# EAGLE design PCM5102A_Breakout (EAGLE 9.6.2)
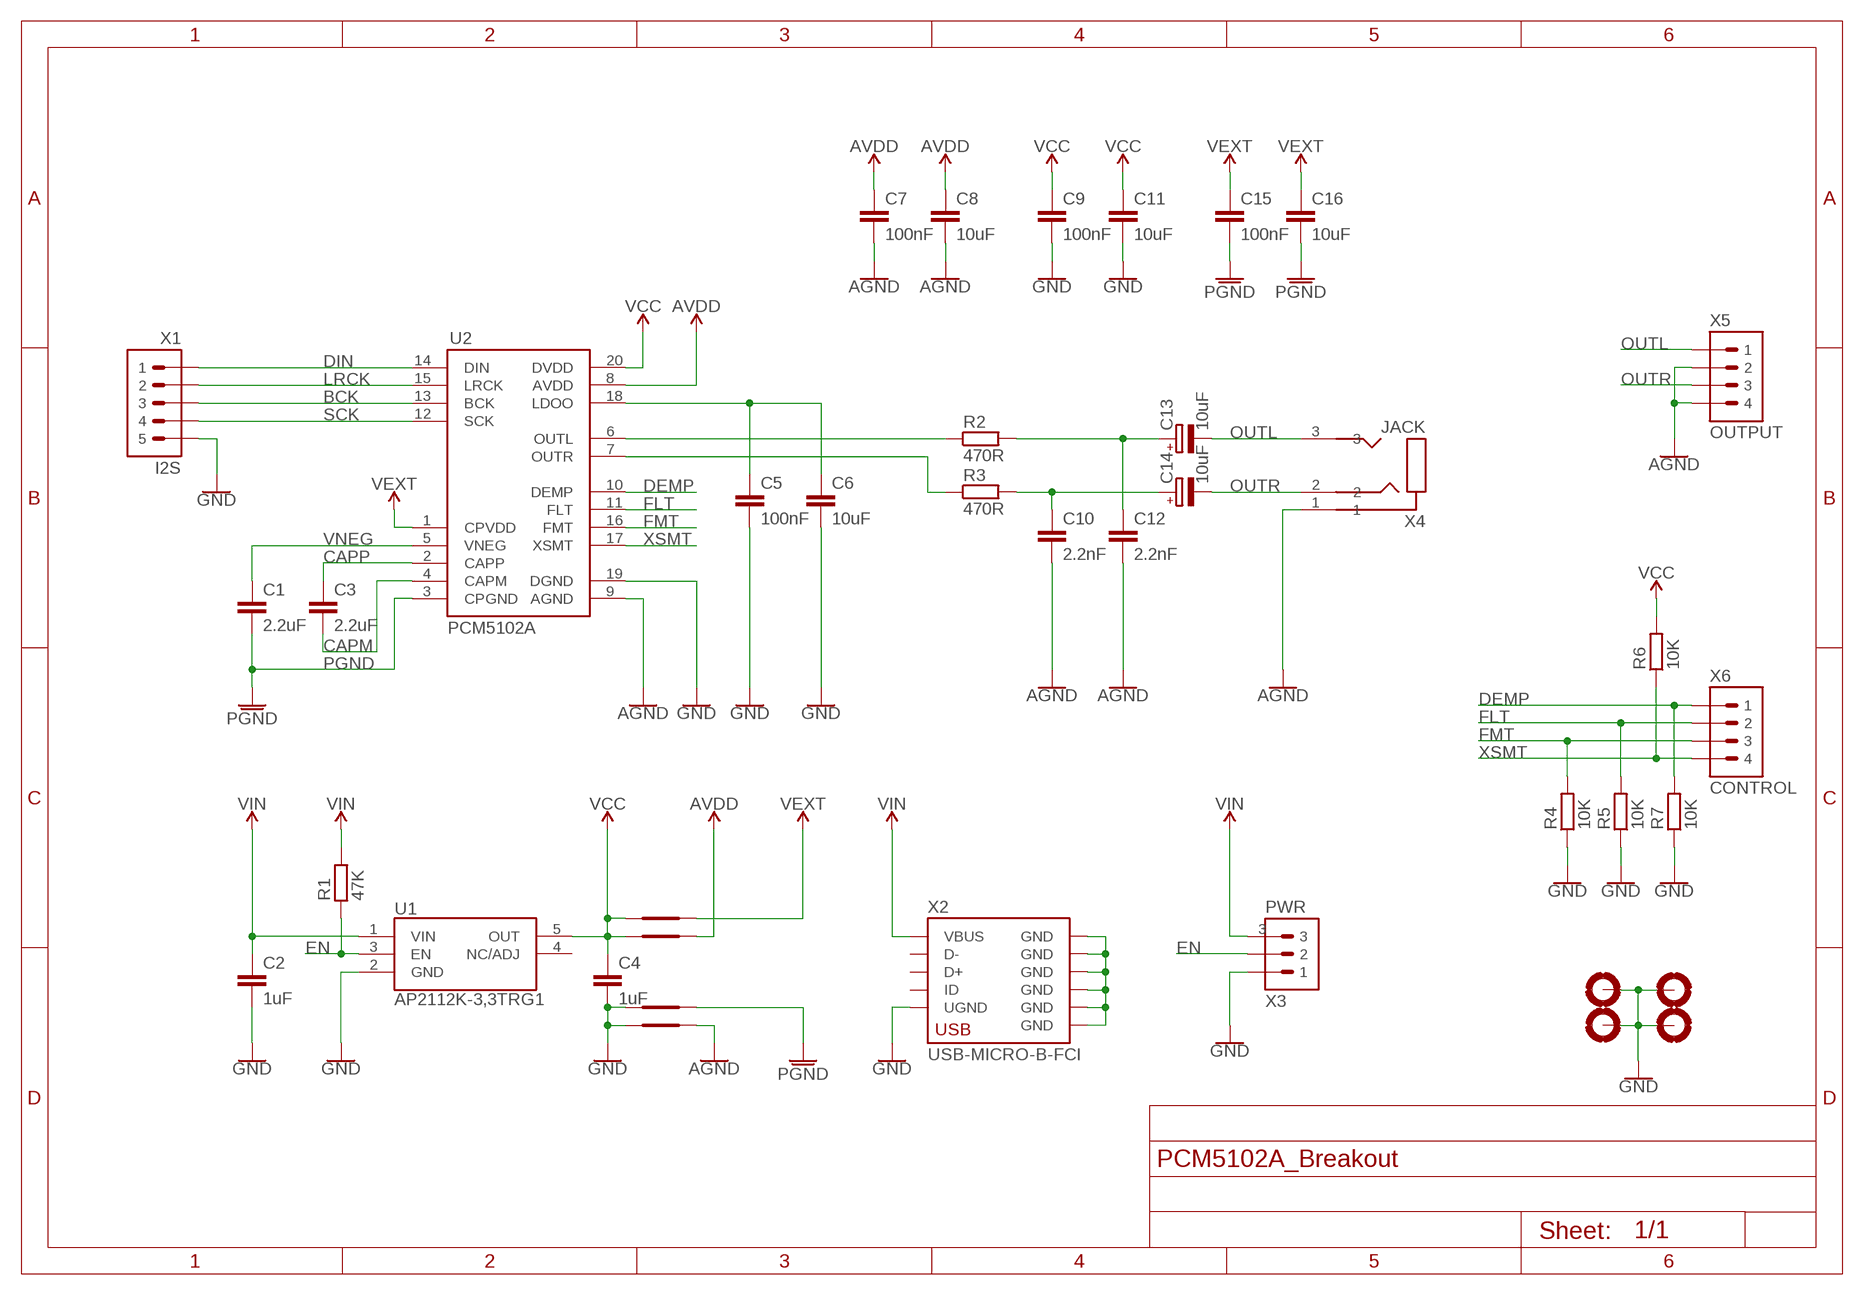
[diagram p0: schematic, sheet 1]

## Parts
C1  2.2uF  CAPC0603  [C0603]
C2  1uF  CAPC0603  [C0603]
C3  2.2uF  CAPC0603  [C0603]
C4  1uF  CAPC0603  [C0603]
C5  100nF  CAPC0603  [C0603]
C6  10uF  CAPC0603  [C0603]
C7  100nF  CAPC0603  [C0603]
C8  10uF  CAPC0603  [C0603]
C9  100nF  CAPC0603  [C0603]
C10  2.2nF  CAPC0603  [C0603]
C11  10uF  CAPC0603  [C0603]
C12  2.2nF  CAPC0603  [C0603]
C13  10uF  CAP-POL-ALUMROQANG-RVT0405  [ROQANG-RVT0405]
C14  10uF  CAP-POL-ALUMROQANG-RVT0405  [ROQANG-RVT0405]
C15  100nF  CAPC0603  [C0603]
C16  10uF  CAPC0603  [C0603]
H1  MOUNTHOLE-PAD3.2  [3.2-PAD]
H2  MOUNTHOLE-PAD3.2  [3.2-PAD]
H3  MOUNTHOLE-PAD3.2  [3.2-PAD]
H4  MOUNTHOLE-PAD3.2  [3.2-PAD]
R1  47K  RESISTOR0603  [R0603]
R2  470R  RESISTOR0603  [R0603]
R3  470R  RESISTOR0603  [R0603]
R4  10K  RESISTOR0603  [R0603]
R5  10K  RESISTOR0603  [R0603]
R6  10K  RESISTOR0603  [R0603]
R7  10K  RESISTOR0603  [R0603]
SH1  SHORT-SMD-06096  [SHORT-SMD-06096]
SH2  SHORT-SMD-06096  [SHORT-SMD-06096]
SH3  SHORT-SMD-06096  [SHORT-SMD-06096]
SH4  SHORT-SMD-06096  [SHORT-SMD-06096]
U1  AP2112K-3,3TRG1  REGULATOR-AP2112KK-SOT23-5  [SOT23-5]
U2  PCM5102A  PCM5102APWR  [TSSOP-20]
X1  I2S  HEADER-1X05-2.54  [1X05-2.54]
X2  USB-MICRO-B-FCI  [USB-MICRO-B-FCI]
X3  PWR  HEADER-1X03-2.54P  [1X03P-2.54]
X4  JACK  AUDIO-3.5-SJ1-3523N  [AUDIO-3.5-SJ1-3523N]
X5  OUTPUT  HEADER-1X04-2.54  [1X04-2.54]
X6  CONTROL  HEADER-1X04-2.54  [1X04-2.54]

## Nets
AGND: C7.2 C8.2 C10.2 C12.2 SH4.2 U2.9(AGND) X4.1 X5.2 X5.4
AVDD: C7.1 C8.1 SH2.2 U2.8(AVDD)
BCK: U2.13(BCK) X1.3
CAPM: C3.2 U2.4(CAPM)
CAPP: C3.1 U2.2(CAPP)
DEMP: R7.2 U2.10(DEMP) X6.1
DIN: U2.14(DIN) X1.1
EN: R1.1 U1.3(EN) X3.2
FLT: R5.2 U2.11(FLT) X6.2
FMT: R4.2 U2.16(FMT) X6.3
GND: C2.2 C4.2 C5.2 C6.2 C9.2 C11.2 H1.B3,2(MOUNT) H2.B3,2(MOUNT) H3.B3,2(MOUNT) H4.B3,2(MOUNT) R4.1 R5.1 R7.1 SH3.1 SH4.1 U1.2(GND) U2.19(DGND) X1.5 X2.5(UGND) X3.1
LRCK: U2.15(LRCK) X1.2
N$1: C5.1 C6.1 U2.18(LDOO)
N$2: R2.1 U2.6(OUTL)
N$7: R3.1 U2.7(OUTR)
N$8: C12.1 C13.+ R2.2
N$9: C10.1 C14.+ R3.2
N$10: X2.GND@1(GND) X2.GND@2(GND) X2.GND@3(GND) X2.GND@4(GND) X2.GND@5(GND) X2.GND@6(GND)
OUTL: C13.- X4.3 X5.1
OUTR: C14.- X4.2 X5.3
PGND: C1.2 C15.2 C16.2 SH3.2 U2.3(CPGND)
SCK: U2.12(SCK) X1.4
VCC: C4.1 C9.1 C11.1 R6.2 SH1.1 SH2.1 U1.5(OUT) U2.20(DVDD)
VEXT: C15.1 C16.1 SH1.2 U2.1(CPVDD)
VIN: C2.1 R1.2 U1.1(VIN) X2.1(VBUS) X3.3
VNEG: C1.1 U2.5(VNEG)
XSMT: R6.1 U2.17(XSMT) X6.4
Unconnected: U1.4(NC/ADJ) X2.2(D-) X2.3(D+) X2.4(ID)

## Library data of the parts
C1-C12 C15 C16 = M2M-Passives:CAP
C13 C14 = M2M-Passives:CAP-POL-ALUM
H1-H4 = M2M-Holes:MOUNTHOLE-PAD
R1-R7 = M2M-Passives:RESISTOR
SH1-SH4 = M2M-Connectors:SHORT
U1 = M2M-IC:REGULATOR-AP2112K
U2 = M2M-IC:PCM5102A
X1 = M2M-Connectors:HEADER-1X05-2.54
X2 = M2M-Connectors:USB-MICRO-B-FCI: FCI-10118192-0001LF 609-4613-1-ND
X3 = M2M-Connectors:HEADER-1X03-2.54
X4 = M2M-Connectors:AUDIO-3.5-SJ1-3523N
X5 X6 = M2M-Connectors:HEADER-1X04-2.54

## Board
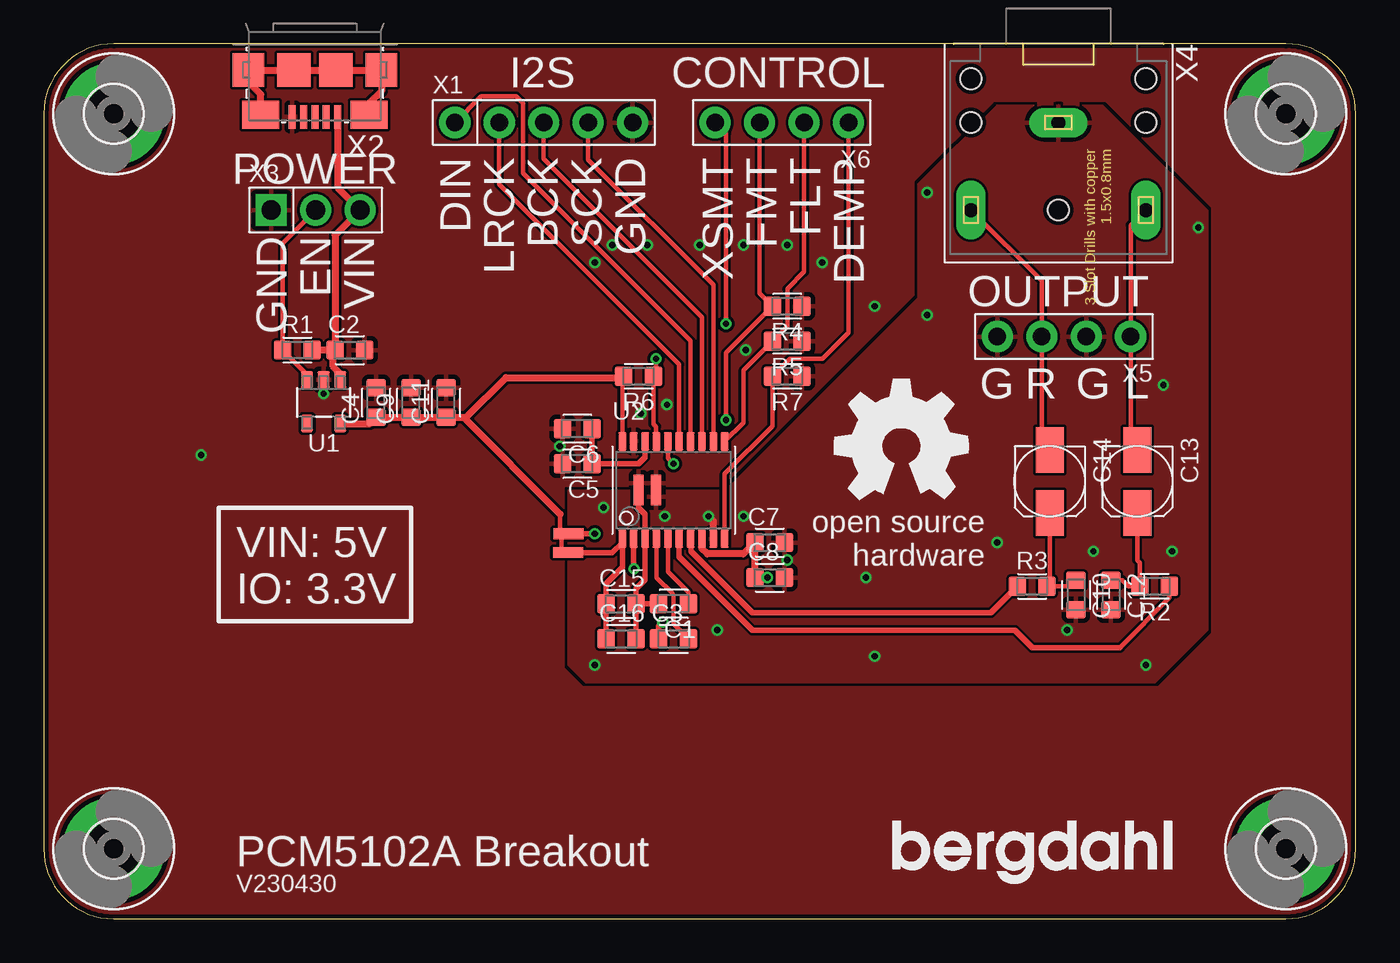
[diagram p1: board, top side]
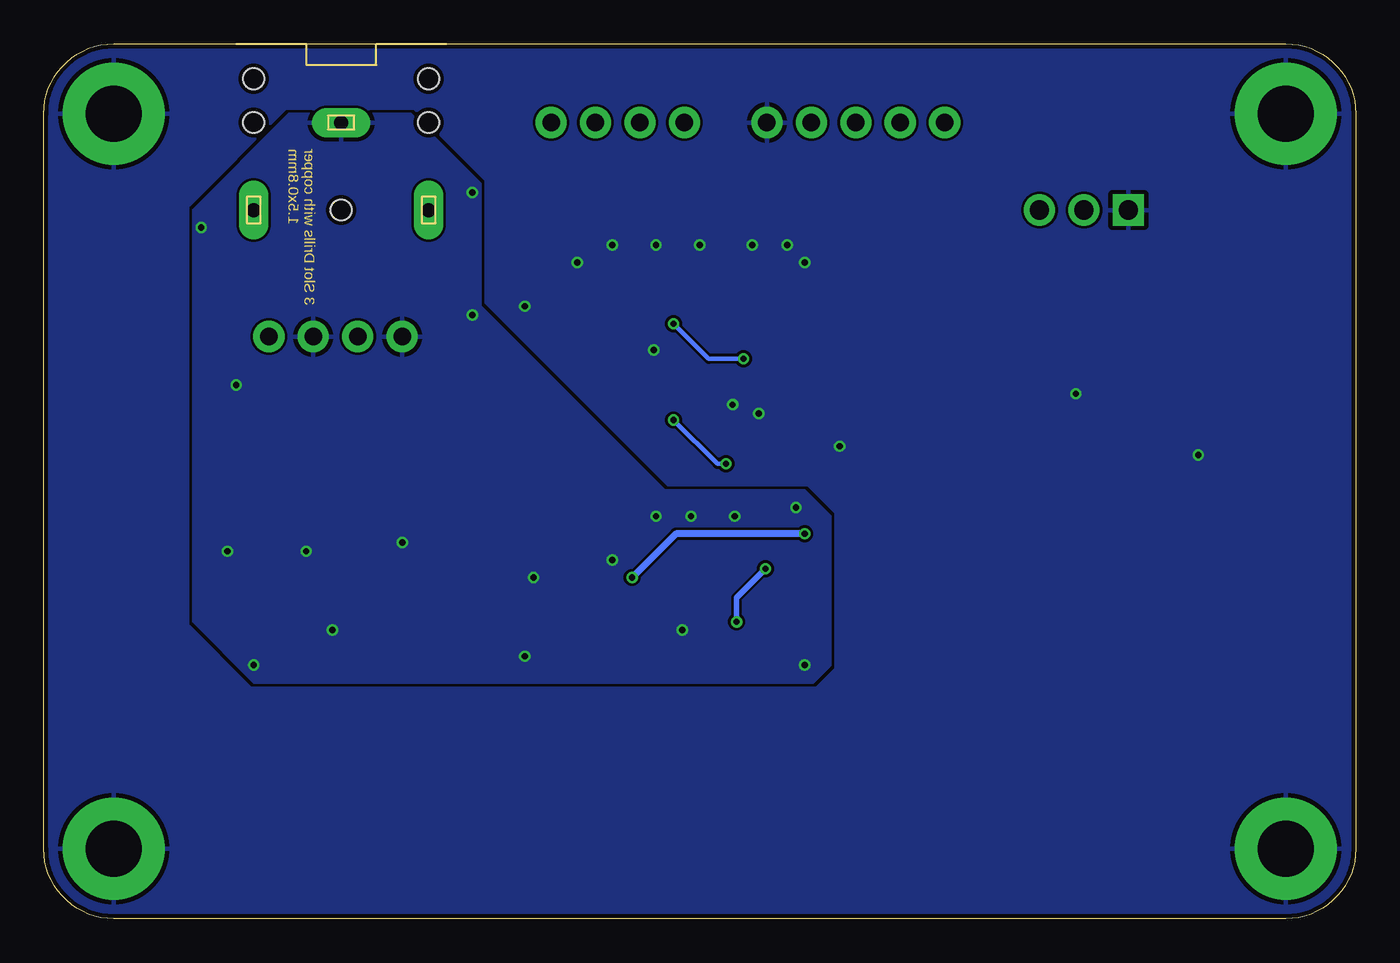
[diagram p2: board, bottom side, seen from below]

Size 75 x 50 mm. Coordinates in mm from the lower left corner, seen from the top.
Outline: 0,46 0,4 arc90 4,0 71,0 arc90 75,4 75,46 arc90 71,50 4,50 arc90 0,46
Copper layers (1*16): Top 0.035mm / dielectric 1.5mm / Bottom 0.035mm
Design rules "SeeedStudio_2layer_DRU_no_angle_20140221": minimum track width 6mil, minimum drill 0.3mm, track to track 6mil, track to pad 6mil, pad to pad 6mil, via to via 6mil, smd to smd 0mil, copper to edge 10mil, drill to drill 10mil, minimum pad ring 2mil, minimum via ring 6mil, stop-mask expansion 2mil, vias tented up to drill 1000mil, thermal gap 10mil

### Footprints (pad centres in the part's own frame; a part is rotated, then mirrored left to right if it is on the bottom)
C0603 = smd 1 x 1.1: 1 -0.85,0; 2 0.85,0
ROQANG-RVT0405 = smd 1.6 x 2.6: + 0,1.8; - 0,-1.8
3.2-PAD = drill 3.2 pad 5.842: B3,2 0,0
R0603 = smd 1 x 1.1: 1 -0.85,0; 2 0.85,0
SHORT-SMD-06096 = smd 1 x 0.61: 1 -0.381,0; 2 0.381,0
SOT23-5 = smd 0.7 x 1: 1 -0.95,-1.3; 2 0,-1.3; 3 0.95,-1.3; 4 0.95,1.2; 5 -0.95,1.2
TSSOP-20 = smd 0.45 x 1.05: 1 -2.925,-2.775; 2 -2.275,-2.775; 3 -1.625,-2.775; 4 -0.975,-2.775; 5 -0.325,-2.775; 6 0.325,-2.775; 7 0.975,-2.775; 8 1.625,-2.775; 9 2.275,-2.775; 10 2.925,-2.775; 11 2.925,2.775; 12 2.275,2.775; 13 1.625,2.775; 14 0.975,2.775; 15 0.325,2.775; 16 -0.325,2.775; 17 -0.975,2.775; 18 -1.625,2.775; 19 -2.275,2.775; 20 -2.925,2.775
1X05-2.54 = drill 1 pad 1.778: 1 0,0; 2 2.54,0; 3 5.08,0; 4 7.62,0; 5 10.16,0
USB-MICRO-B-FCI = smd 0.4 x 1.35: 1 -1.3,2.675; 2 -0.65,2.675; 3 0,2.675; 4 0.65,2.675; 5 1.3,2.675 | smd 2.1 x 1.6: GND@1 -3.1,2.55; GND@2 3.1,2.55 | smd 1.8 x 1.9: GND@3 -3.8,0; GND@6 3.8,0 | smd 1.9 x 1.9: GND@4 -1.2,0; GND@5 1.2,0
1X03P-2.54 = drill 1.1 pad 1.778 square: 1 0,0 | drill 1.1 pad 1.778: 2 2.54,0; 3 5.08,0
AUDIO-3.5-SJ1-3523N = drill 0.8 pad 1.676 long: 1 0,0; 2 5,-5; 3 5,5 | hole 1.2: 5,0; 0,5; -2.5,5; -2.5,-5; 0,-5
1X04-2.54 = drill 1 pad 1.778: 1 0,0; 2 2.54,0; 3 5.08,0; 4 7.62,0

### Placement (x,y rotation side)
C1  36,18 180 top
C2  17.5,32.5 0 top
C3  36,16 0 top
C4  19,29.5 90 top
C5  30.5,26 180 top
C6  30.5,28 180 top
C7  41.5,21.5 0 top
C8  41.5,19.5 0 top
C9  21,29.5 90 top
C10  59,18.5 270 top
C11  23,29.5 90 top
C12  61,18.5 270 top
C13  62.5,25 180 top
C14  57.5,25 180 top
C15  33,18 0 top
C16  33,16 0 top
H1  4,4 0 top
H2  71,4 0 top
H3  4,46 0 top
H4  71,46 0 top
R1  14.5,32.5 0 top
R2  63.5,19 180 top
R3  56.5,19 0 top
R4  42.5,35 180 top
R5  42.5,33 180 top
R6  34,31 180 top
R7  42.5,31 180 top
SH1  29.97,20.92 0 top
SH2  30,22 0 top
SH3  34,24.5 270 top
SH4  35,24.5 270 top
U1  16,29.5 180 top
U2  36,24.5 0 top
U$1  [BERGDAHL-20MM-TPLACE]  48.5,2 0 top
U$2  [OSHW-8MM-TPLACE]  49,27 0 top
X1  23.5,45.5 0 top
X2  15.5,48.5 180 top
X3  13,40.5 0 top
X4  58,45.5 270 top
X5  62.13,33.27 180 top
X6  46,45.5 180 top

### Tracks (layer width: path | path; a pad name or v marks a point on that pad's centre or on a via)
AGND  (via drill 0.35)
  Top 0.406: U2.9 38.27,22.73 v38,23
  other vias: 35.5,23 32,23.5 38.5,16.5 31.5,14.5 63,14.5 64.5,21 64,30.5 66,39.5 60,21 54.5,21.5 50.5,34.5 58.5,16.5 47,19.5 47.5,15 40,23 42.5,20.5 50.5,41.5
  pour Top: 30,24.5 39,24.5 49,34.5 50,35.5 50,42 54.5,46.5 58,46.5 60.5,46.5 65.5,41.5 66.5,40.5 66.5,17.5 66.5,16.5 63.5,13.5 31,13.5 30,14.5
  pour Bottom: 30,14.5 30,23 31.5,24.5 38.5,24.5 39.5,24.5 50,35 50,42 54,46 56,46 61,46 66.5,40.5 66.5,17 63,13.5 31,13.5
AVDD  (via drill 0.35)
  Top 0.305: SH2.2 v31.5,22
  Top 0.406: v41.37,19.5 C8.1 C7.1 39.99,20.84 37.94,20.84 37.62,21.16 U2.8
  Bottom 0.406: v31.5,22 38.87,22 v41.37,19.5
BCK
  Top 0.254: U2.13 37.62,34.38 28.58,43.42 X1.3
CAPM
  Top 0.254: U2.4 35.02,19.5 35.93,18.59 35.93,18.57 36,18.5 36,16.85 C3.2
CAPP  (via drill 0.35)
  Top 0.305: U2.2 33.73,20.02 v33.74,20 | v35.39,16.97 35.15,16.73 C3.1
  Bottom 0.305: v33.74,20 35.39,18.35 v35.39,16.97
DEMP
  Top 0.254: U2.10 38.92,25.43 41.65,28.15 R7.2 42.65,32 44.5,32 46,33.5 X6.1
DIN
  Top 0.254: X1.1 25,47 27,47 27.41,46.59 27.41,42.59 36.98,33.02 U2.14
EN
  Top 0.254: X3.2 13.65,38.61 R1.1 15.05,31.1 U1.3
FLT
  Top 0.254: X6.2 43.46,36.96 42.5,36 42.5,33.85 R5.2 40,31.35 40,28.35 U2.11
FMT  (via drill 0.35)
  Top 0.254: X6.3 40.92,35.73 R4.2 39,32.35 v39,28.5 | U2.16 35.67,26.32 v36,26
  Bottom 0.254: v36,26 36.5,26 v39,28.5
GND  (via drill 0.35)
  other vias: 9,26.5 31.5,37.5 32.5,38.5 34.5,38.5 37.5,38.5 40,38.5 42.5,38.5 40.13,32.5 44.5,37.5 47.5,35 16,30 29.5,27 35.63,29.37 34.13,28.87
  pour Top (rank 5): 0,50 75,50 75,0 0,0
  pour Bottom (rank 4): 0,50 75,50 75,0 0,0
LRCK
  Top 0.254: U2.15 36.33,31.68 26.04,41.96 X1.2
N$1
  Top 0.305: U2.18 34.38,26.38 34,26 C5.1 C6.1
N$2
  Top 0.254: R2.1 64.35,18.35 61.5,15.5
  Top 0.305: U2.6 36.33,20.68 40.5,16.5 55.5,16.5 56.5,15.5 61.5,15.5
N$7
  Top 0.305: U2.7 37,21.7 37,21 40.5,17.5 54.15,17.5 R3.1
N$8
  Top 0.254: C13.+ 62.5,20.5 62.65,20.35 R2.2 62,19 61.65,19.35 C12.1
N$9
  Top 0.254: C14.+ 57.5,19.15 R3.2 58.65,19 C10.1
N$10
  Top 0.406: X2.GND@2 12.4,47.1 11.5,48 11.5,48.3 X2.GND@6 X2.GND@5 X2.GND@4 X2.GND@3 19.3,47.3 18.6,46.6 X2.GND@1
OUTL
  Top 0.254: X4.3 62.13,39.63 X5.1 62.13,27.17 C13.-
OUTR
  Top 0.254: X4.2 57.05,36.45 X5.3 57.05,27.25 C14.-
PGND
  Top 0.305: C15.2 33.85,18.85 34.38,19.38 U2.3 34.38,23.12 34,23.5 SH3.2 | C1.2 C15.2 | C15.2 C16.2
SCK
  Top 0.254: U2.12 38.27,36.23 31.12,43.38 X1.4
VCC
  Top 0.254: U2.20 33.08,30.93 R6.2 | SH1.1 29.59,21.97 SH2.1 29.52,22.09 29.52,23.12
  Top 0.406: U1.5 18.65,28.3 C4.1 C9.1 C11.1 24,28.65 | 24,28.65 24.15,28.65 26.43,30.93 33.08,30.93 | 29.52,23.12 24,28.65
VEXT
  Top 0.305: C16.1 C15.1 32.15,19.15 33.08,20.07 33.08,21.5 | U2.1 33.08,21.5 | SH1.2 32.49,20.92 33.08,21.5
VIN
  Top 0.406: X2.1 16.8,41.78 X3.3 16.65,39.07 C2.1 | U1.1 16.95,31.15 16.55,31.55 16.55,32.4 C2.1 | C2.1 R1.2
VNEG
  Top 0.254: U2.5 35.67,19.82 36.85,18.65 C1.1
XSMT  (via drill 0.35)
  Top 0.254: 35.02,30.82 R6.1 | R6.1 35,31.15 v35,32 | v39,34 39,44.88 X6.4 | U2.17 35,27.27 35,28.12 34.85,28.27 R6.1
  Bottom 0.254: v35,32 37,32 v39,34

### Text on the board
tPlace: I2S | CONTROL | DIN | LRCK | BCK | SCK | GND | XSMT | FMT | FLT | DEMP | POWER | GND | EN | VIN | OUTPUT | G | R | G | L | VIN: 5V / IO: 3.3V | PCM5102A Breakout | V230430